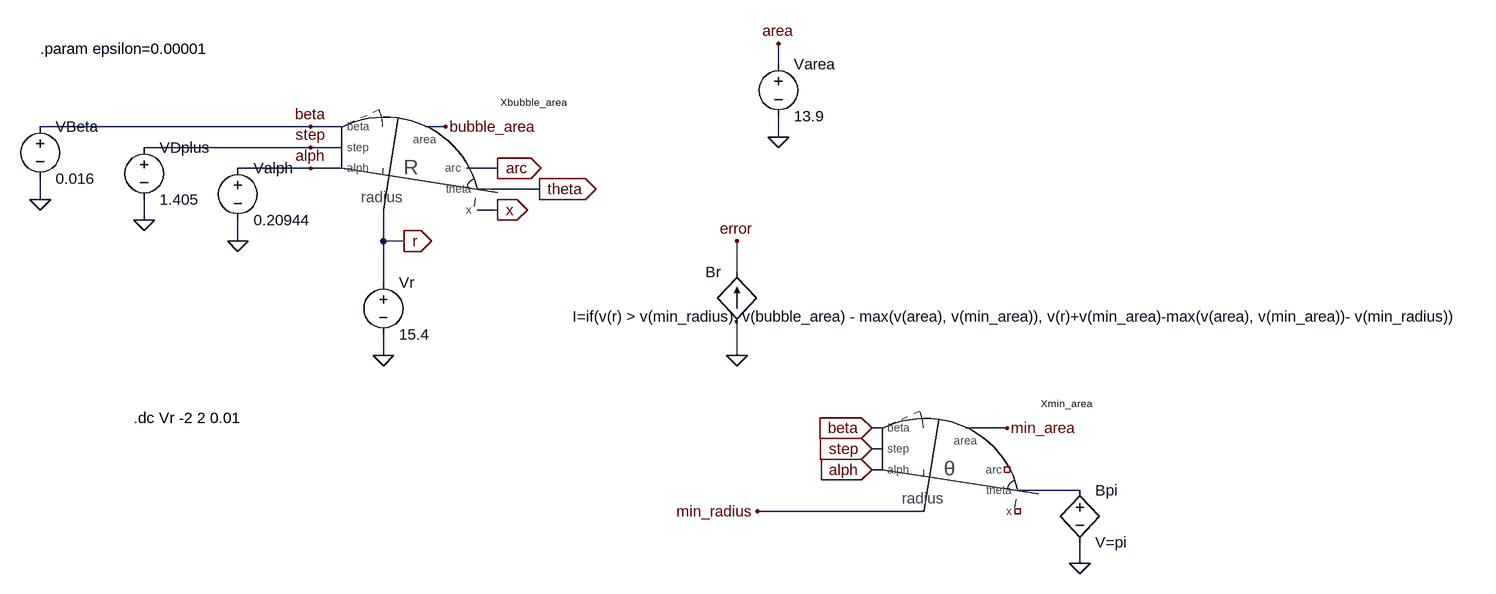
[diagram p0: schematic bubble_volume_min_test.asc]
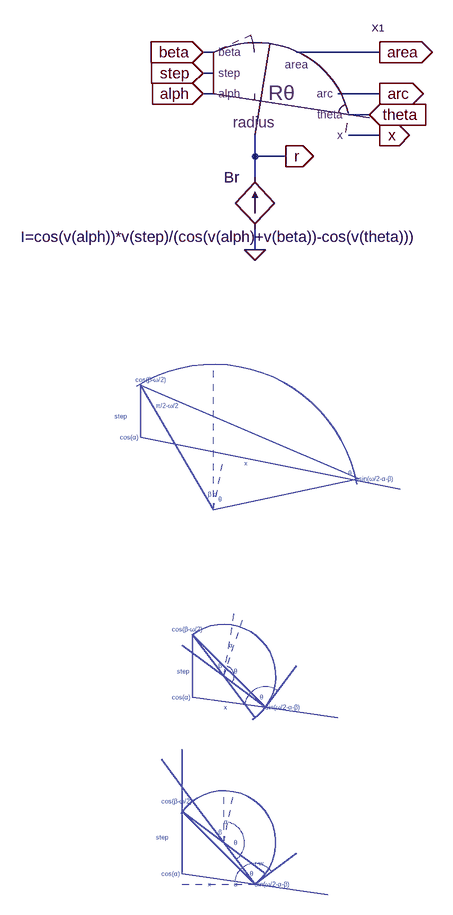
[diagram p1: sub-circuit bubble_volume_theta.asc]
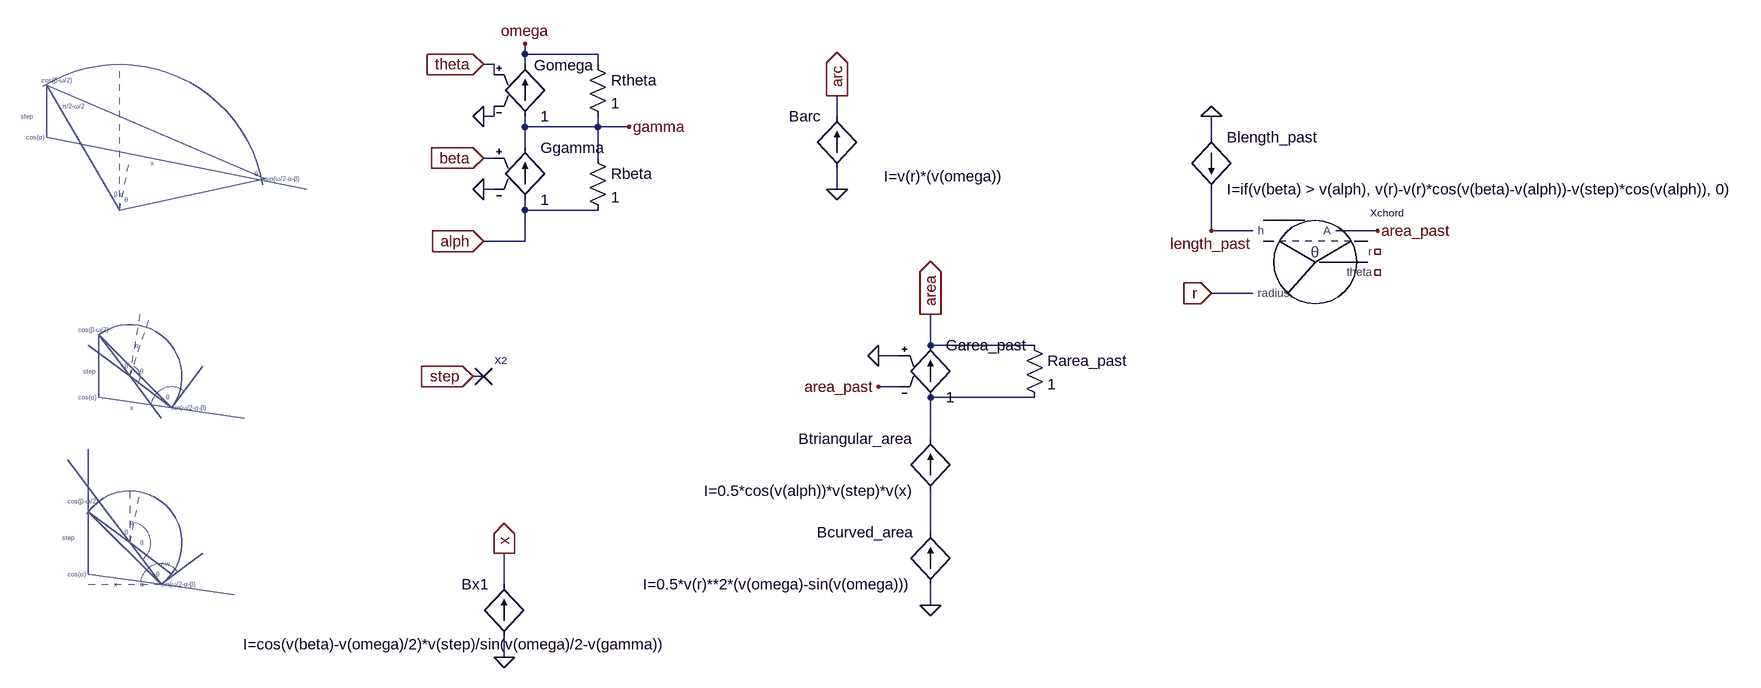
[diagram p2: sub-circuit bubble_volume_r-theta.asc]
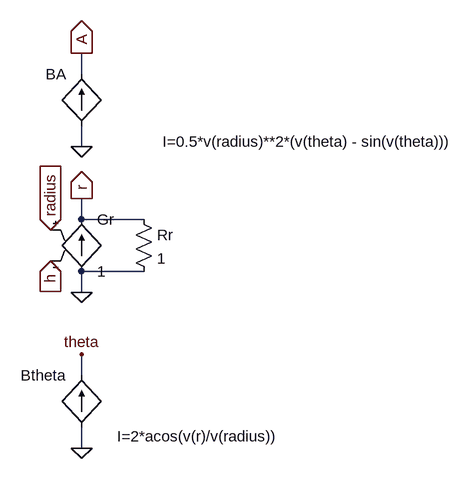
[diagram p3: sub-circuit chord.asc]
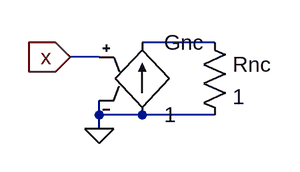
[diagram p4: sub-circuit nc.asc]
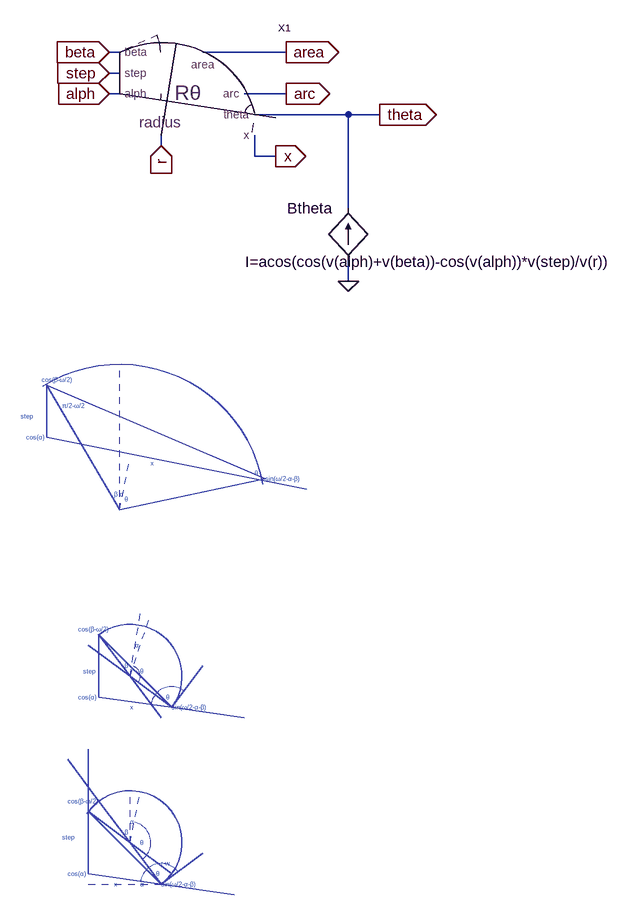
[diagram p5: sub-circuit bubble_volume_r.asc]
bubble_volume_min_test.asc, the LTspice schematic file:
Version 4
SHEET 1 2232 852
WIRE 864 -64 864 -96
WIRE 144 32 -272 32
WIRE 192 32 144 32
WIRE 352 32 320 32
WIRE 864 48 864 16
WIRE 144 64 -112 64
WIRE 192 64 144 64
WIRE 144 96 32 96
WIRE 192 96 144 96
WIRE 432 96 384 96
WIRE 496 128 400 128
WIRE -272 144 -272 112
WIRE 432 160 400 160
WIRE -112 176 -112 144
WIRE 32 208 32 176
WIRE 256 208 256 160
WIRE 288 208 256 208
WIRE 800 256 800 208
WIRE 256 272 256 208
WIRE 256 384 256 352
WIRE 800 384 800 336
WIRE 1024 496 1008 496
WIRE 1216 496 1152 496
WIRE 1024 528 1008 528
WIRE 1024 560 1008 560
WIRE 1328 592 1232 592
WIRE 1088 624 832 624
WIRE 1328 704 1328 672
FLAG 288 208 r
IOPIN 288 208 Out
FLAG 496 128 theta
IOPIN 496 128 Out
FLAG 432 96 arc
IOPIN 432 96 Out
FLAG 352 32 bubble_area
FLAG 432 160 x
IOPIN 432 160 Out
FLAG 1008 528 step
IOPIN 1008 528 In
FLAG 1008 560 alph
IOPIN 1008 560 In
FLAG 1008 496 beta
IOPIN 1008 496 In
FLAG 1328 704 0
FLAG 1216 496 min_area
FLAG 832 624 min_radius
FLAG 800 384 0
FLAG -272 144 0
FLAG -112 176 0
FLAG 32 208 0
FLAG 144 32 beta
FLAG 144 64 step
FLAG 144 96 alph
FLAG 800 208 error
FLAG 256 384 0
FLAG 864 -96 area
FLAG 864 48 0
SYMBOL bubble_volume_theta 1120 560 R0
SYMATTR InstName Xmin_area
SYMBOL bv 1328 576 R0
SYMATTR InstName Bpi
SYMATTR Value V=pi
SYMBOL bubble_volume_r 288 96 R0
SYMATTR InstName Xbubble_area
SYMBOL bi 800 336 R180
WINDOW 0 24 80 Left 2
WINDOW 3 -1137 12 Left 2
SYMATTR InstName Br
SYMATTR Value I=if(v(r) > v(min_radius), v(bubble_area) - max(v(area), v(min_area)), v(r)+v(min_area)-max(v(area), v(min_area))- v(min_radius))
SYMATTR SpiceLine rpar=1
SYMBOL voltage -112 48 R0
SYMATTR InstName VDplus
SYMATTR Value 1.405
SYMBOL voltage 32 80 R0
SYMATTR InstName Valph
SYMATTR Value 0.20944
SYMBOL voltage -272 16 R0
SYMATTR InstName VBeta
SYMATTR Value 0.016
SYMBOL voltage 256 256 R0
SYMATTR InstName Vr
SYMATTR Value 15.4
SYMBOL voltage 864 -80 R0
SYMATTR InstName Varea
SYMATTR Value 13.9
TEXT -272 -88 Left 2 !.param epsilon=0.00001
TEXT -128 480 Left 2 !.dc Vr -2 2 0.01

bubble_volume_theta.asc, the sub-circuit schematic file:
Version 4
SHEET 1 2232 852
WIRE -720 -464 -736 -464
WIRE -464 -464 -592 -464
WIRE -720 -432 -736 -432
WIRE -720 -400 -736 -400
WIRE -464 -400 -528 -400
WIRE -480 -368 -512 -368
WIRE -464 -336 -512 -336
WIRE -656 -304 -656 -336
WIRE -608 -304 -656 -304
WIRE -656 -272 -656 -304
WIRE -656 -160 -656 -192
FLAG -464 -464 area
IOPIN -464 -464 Out
FLAG -464 -400 arc
IOPIN -464 -400 Out
FLAG -464 -336 x
IOPIN -464 -336 Out
FLAG -736 -432 step
IOPIN -736 -432 In
FLAG -480 -368 theta
IOPIN -480 -368 In
FLAG -736 -464 beta
IOPIN -736 -464 In
FLAG -736 -400 alph
IOPIN -736 -400 In
FLAG -608 -304 r
IOPIN -608 -304 Out
FLAG -656 -160 0
SYMBOL bi -656 -192 R180
WINDOW 0 24 80 Left 2
WINDOW 3 -258 -12 Left 2
SYMATTR InstName Br
SYMATTR Value I=cos(v(alph))*v(step)/(cos(v(alph)+v(beta))-cos(v(theta)))
SYMATTR SpiceLine rpar=1
SYMBOL bubble_volume_r-theta -624 -400 R0
SYMATTR InstName X1
TEXT -872 96 Left 0 ;step
TEXT -840 40 Left 0 ;cos(β-ω/2)
TEXT -728 216 Left 0 ;β
TEXT -720 216 Left 0 ;α
TEXT -712 224 Left 0 ;θ
TEXT -512 184 Left 0 ;θ
TEXT -864 128 Left 0 ;cos(α)
TEXT -776 488 Left 0 ;step
TEXT -688 488 Left 0 ;θ
TEXT -648 528 Left 0 ;θ
TEXT -784 528 Left 0 ;cos(α)
TEXT -712 480 Left 0 ;β
TEXT -696 448 Left 0 ;α
TEXT -808 744 Left 0 ;step
TEXT -688 816 Left 0 ;α
TEXT -688 752 Left 0 ;θ
TEXT -664 800 Left 0 ;θ
TEXT -800 800 Left 0 ;cos(α)
TEXT -712 736 Left 0 ;β
TEXT -704 720 Left 0 ;α
TEXT -656 784 Left 0 ;r-w
TEXT -672 168 Left 0 ;x
TEXT -704 544 Left 0 ;x
TEXT -784 424 Left 0 ;cos(β-ω/2)
TEXT -728 816 Left 0 ;x
TEXT -800 688 Left 0 ;cos(β-ω/2)
TEXT -808 80 Left 0 ;π/2-ω/2
TEXT -496 192 Left 0 ;sin(ω/2-α-β)
TEXT -640 544 Left 0 ;sin(ω/2-α-β)
TEXT -656 816 Left 0 ;sin(ω/2-α-β)
LINE Normal -832 128 -832 48
LINE Normal -832 128 -432 208
LINE Normal -720 240 -832 48
LINE Normal -720 240 -720 16 2
LINE Normal -720 240 -704 160 2
LINE Normal -496 192 -720 240
LINE Normal -752 528 -752 432
LINE Normal -752 528 -640 544
LINE Normal -704 496 -752 432
LINE Normal -704 496 -688 400 2
LINE Normal -704 496 -672 400 2
LINE Normal -640 544 -592 480
LINE Normal -640 544 -704 496
LINE Normal -640 544 -528 560
LINE Normal -640 544 -752 432
LINE Normal -768 800 -768 704
LINE Normal -768 800 -656 816
LINE Normal -704 752 -768 704
LINE Normal -704 752 -704 672 2
LINE Normal -704 752 -688 672 2
LINE Normal -656 816 -592 768
LINE Normal -768 816 -656 816 2
LINE Normal -656 816 -704 752
LINE Normal -640 800 -704 752
LINE Normal -656 816 -544 832
LINE Normal -656 816 -768 704
LINE Normal -656 560 -704 496
LINE Normal -704 496 -768 448
LINE Normal -704 752 -752 688
LINE Normal -752 688 -800 624
LINE Normal -768 704 -768 608
LINE Normal -496 192 -832 48
ARC Normal -944 16 -496 464 -506 202 -839 48
ARC Normal -784 416 -624 576 -602 650 -791 384
ARC Normal -672 512 -608 576 -560 442 -747 530 2
ARC Normal -720 480 -688 512 -672 522 -683 434 2
ARC Normal -784 672 -624 832 -650 826 -775 704
ARC Normal -688 784 -624 848 -608 778 -763 802 2
ARC Normal -736 720 -672 784 -672 794 -683 658 2

bubble_volume_r-theta.asc, the sub-circuit schematic file:
Version 4
SHEET 1 2232 852
WIRE -144 -720 -144 -736
WIRE -32 -720 -144 -720
WIRE -192 -704 -208 -704
WIRE -144 -704 -144 -720
WIRE -32 -704 -32 -720
WIRE -192 -688 -192 -704
WIRE -192 -624 -192 -640
WIRE -192 -624 -208 -624
WIRE 336 -624 336 -656
WIRE -144 -608 -144 -624
WIRE -32 -608 -32 -624
WIRE -32 -608 -144 -608
WIRE 16 -608 -32 -608
WIRE 912 -592 912 -624
WIRE -144 -576 -144 -608
WIRE -192 -560 -208 -560
WIRE -32 -560 -32 -608
WIRE -192 -512 -208 -512
WIRE 336 -512 336 -544
WIRE -144 -480 -144 -496
WIRE -32 -480 -144 -480
WIRE 912 -448 912 -512
WIRE 976 -448 912 -448
WIRE 1168 -448 1104 -448
WIRE -144 -432 -144 -480
WIRE -144 -432 -208 -432
WIRE 976 -352 912 -352
WIRE 480 -272 480 -320
WIRE 640 -272 480 -272
WIRE 432 -256 400 -256
WIRE -208 -224 -224 -224
WIRE 432 -208 400 -208
WIRE 640 -192 480 -192
WIRE 480 -128 480 -192
WIRE 480 16 480 -48
WIRE -176 96 -176 48
WIRE 480 128 480 96
WIRE -176 208 -176 176
FLAG 912 -352 r
IOPIN 912 -352 In
FLAG 912 -448 length_past
FLAG -208 -704 theta
IOPIN -208 -704 In
FLAG 912 -624 0
FLAG 480 128 0
FLAG -208 -560 beta
IOPIN -208 -560 In
FLAG -224 -224 step
IOPIN -224 -224 In
FLAG -208 -432 alph
IOPIN -208 -432 In
FLAG 480 -320 area
IOPIN 480 -320 Out
FLAG 336 -656 arc
IOPIN 336 -656 Out
FLAG 1168 -448 area_past
FLAG 336 -512 0
FLAG -208 -624 0
FLAG -144 -736 omega
FLAG 16 -608 gamma
FLAG -208 -512 0
FLAG 400 -208 area_past
FLAG 400 -256 0
FLAG -176 48 x
IOPIN -176 48 Out
FLAG -176 208 0
SYMBOL chord 1072 -400 R0
SYMATTR InstName Xchord
SYMBOL bi 336 -544 R180
WINDOW 0 24 80 Left 2
WINDOW 3 -258 -12 Left 2
SYMATTR InstName Barc
SYMATTR Value I=v(r)*(v(omega))
SYMATTR SpiceLine rpar=1
SYMBOL nc -208 -224 R0
SYMATTR InstName X2
SYMBOL bi -176 176 R180
WINDOW 0 24 80 Left 2
WINDOW 3 -258 -12 Left 2
SYMATTR InstName Bx1
SYMATTR Value I=cos(v(beta)-v(omega)/2)*v(step)/sin(v(omega)/2-v(gamma))
SYMATTR SpiceLine rpar=1
SYMBOL g -144 -720 R0
WINDOW 0 14 17 Left 2
SYMATTR InstName Gomega
SYMATTR Value 1
SYMBOL g -144 -592 R0
SYMATTR InstName Ggamma
SYMATTR Value 1
SYMBOL g 480 -288 R0
SYMATTR InstName Garea_past
SYMATTR Value 1
SYMBOL bi 912 -592 R0
SYMATTR InstName Blength_past
SYMATTR Value I=if(v(beta) > v(alph), v(r)-v(r)*cos(v(beta)-v(alph))-v(step)*cos(v(alph)), 0)
SYMATTR SpiceLine rpar=1
SYMBOL res -48 -576 R0
SYMATTR InstName Rbeta
SYMATTR Value 1
SYMBOL res -48 -720 R0
SYMATTR InstName Rtheta
SYMATTR Value 1
SYMBOL bi 480 -48 R180
WINDOW 0 24 80 Left 2
WINDOW 3 24 0 Left 2
SYMATTR InstName Btriangular_area
SYMATTR Value I=0.5*cos(v(alph))*v(step)*v(x)
SYMATTR SpiceLine rpar=1
SYMBOL bi 480 96 R180
WINDOW 0 24 80 Left 2
WINDOW 3 24 0 Left 2
SYMATTR InstName Bcurved_area
SYMATTR Value I=0.5*v(r)**2*(v(omega)-sin(v(omega)))
SYMATTR SpiceLine rpar=1
SYMBOL res 624 -288 R0
SYMATTR InstName Rarea_past
SYMATTR Value 1
TEXT -920 -624 Left 0 ;step
TEXT -888 -680 Left 0 ;cos(β-ω/2)
TEXT -776 -504 Left 0 ;β
TEXT -768 -504 Left 0 ;α
TEXT -760 -496 Left 0 ;θ
TEXT -560 -536 Left 0 ;θ
TEXT -912 -592 Left 0 ;cos(α)
TEXT -824 -232 Left 0 ;step
TEXT -736 -232 Left 0 ;θ
TEXT -696 -192 Left 0 ;θ
TEXT -832 -192 Left 0 ;cos(α)
TEXT -760 -240 Left 0 ;β
TEXT -744 -272 Left 0 ;α
TEXT -856 24 Left 0 ;step
TEXT -736 96 Left 0 ;α
TEXT -736 32 Left 0 ;θ
TEXT -712 80 Left 0 ;θ
TEXT -848 80 Left 0 ;cos(α)
TEXT -760 16 Left 0 ;β
TEXT -752 0 Left 0 ;α
TEXT -704 64 Left 0 ;r-w
TEXT -720 -552 Left 0 ;x
TEXT -752 -176 Left 0 ;x
TEXT -544 -528 Left 0 ;sin(ω/2-α-β)
TEXT -832 -296 Left 0 ;cos(β-ω/2)
TEXT -776 96 Left 0 ;x
TEXT -848 -32 Left 0 ;cos(β-ω/2)
TEXT -856 -640 Left 0 ;π/2-ω/2
TEXT -688 -176 Left 0 ;sin(ω/2-α-β)
TEXT -704 96 Left 0 ;sin(ω/2-α-β)
LINE Normal -880 -592 -880 -672
LINE Normal -880 -592 -480 -512
LINE Normal -768 -480 -880 -672
LINE Normal -768 -480 -768 -704 2
LINE Normal -768 -480 -752 -560 2
LINE Normal -544 -528 -768 -480
LINE Normal -800 -192 -800 -288
LINE Normal -800 -192 -688 -176
LINE Normal -752 -224 -800 -288
LINE Normal -752 -224 -736 -320 2
LINE Normal -752 -224 -720 -320 2
LINE Normal -688 -176 -640 -240
LINE Normal -688 -176 -752 -224
LINE Normal -688 -176 -576 -160
LINE Normal -688 -176 -800 -288
LINE Normal -816 80 -816 -16
LINE Normal -816 80 -704 96
LINE Normal -752 32 -816 -16
LINE Normal -752 32 -752 -48 2
LINE Normal -752 32 -736 -48 2
LINE Normal -704 96 -640 48
LINE Normal -816 96 -704 96 2
LINE Normal -704 96 -752 32
LINE Normal -688 80 -752 32
LINE Normal -704 96 -592 112
LINE Normal -704 96 -816 -16
LINE Normal -704 -160 -752 -224
LINE Normal -752 -224 -816 -272
LINE Normal -752 32 -800 -32
LINE Normal -800 -32 -848 -96
LINE Normal -816 -16 -816 -112
LINE Normal -544 -528 -880 -672
ARC Normal -992 -704 -544 -256 -554 -518 -887 -672
ARC Normal -832 -304 -672 -144 -650 -150 -839 -336
ARC Normal -720 -208 -656 -144 -608 -278 -795 -190 2
ARC Normal -768 -240 -736 -208 -720 -198 -731 -286 2
ARC Normal -832 -48 -672 112 -698 106 -823 -16
ARC Normal -736 64 -672 128 -656 58 -811 82 2
ARC Normal -784 0 -720 64 -720 74 -731 -62 2

chord.asc, the sub-circuit schematic file:
Version 4
SHEET 1 1588 680
WIRE 320 -96 320 -128
WIRE 320 16 320 -16
WIRE 320 128 320 96
WIRE 416 128 320 128
WIRE 416 208 320 208
WIRE 320 240 320 208
WIRE 320 368 320 336
WIRE 320 480 320 448
FLAG 272 192 h
IOPIN 272 192 In
FLAG 272 144 radius
IOPIN 272 144 In
FLAG 320 -128 A
IOPIN 320 -128 Out
FLAG 320 96 r
IOPIN 320 96 Out
FLAG 320 480 0
FLAG 320 336 theta
FLAG 320 16 0
FLAG 320 240 0
SYMBOL bi 320 448 R180
WINDOW 0 24 80 Left 2
WINDOW 3 -304 -14 Left 2
SYMATTR InstName Btheta
SYMATTR Value I=2*acos(v(r)/v(radius))
SYMATTR SpiceLine rpar=1
SYMBOL bi 320 -16 R180
WINDOW 0 24 80 Left 2
WINDOW 3 -574 -24 Left 2
SYMATTR InstName BA
SYMATTR Value I=0.5*v(radius)**2*(v(theta) - sin(v(theta)))
SYMATTR SpiceLine rpar=1
SYMBOL g 320 112 R0
SYMATTR InstName Gr
SYMATTR Value 1
SYMBOL res 400 112 R0
SYMATTR InstName Rr
SYMATTR Value 1

nc.asc, the sub-circuit schematic file:
Version 4
SHEET 1 880 680
WIRE 288 160 208 160
WIRE 160 176 128 176
WIRE 160 240 160 224
WIRE 208 240 160 240
WIRE 288 240 208 240
WIRE 160 256 160 240
FLAG 128 176 x
IOPIN 128 176 In
FLAG 160 256 0
SYMBOL res 272 144 R0
SYMATTR InstName Rnc
SYMATTR Value 1
SYMBOL g 208 144 R0
SYMATTR InstName Gnc
SYMATTR Value 1

bubble_volume_r.asc, the sub-circuit schematic file:
Version 4
SHEET 1 2232 852
WIRE -720 -464 -736 -464
WIRE -464 -464 -592 -464
WIRE -720 -432 -736 -432
WIRE -720 -400 -736 -400
WIRE -464 -400 -528 -400
WIRE -368 -368 -512 -368
WIRE -320 -368 -368 -368
WIRE -656 -320 -656 -336
WIRE -512 -304 -512 -336
WIRE -480 -304 -512 -304
WIRE -368 -224 -368 -368
WIRE -368 -112 -368 -144
FLAG -464 -464 area
IOPIN -464 -464 Out
FLAG -464 -400 arc
IOPIN -464 -400 Out
FLAG -480 -304 x
IOPIN -480 -304 Out
FLAG -368 -112 0
FLAG -736 -432 step
IOPIN -736 -432 In
FLAG -320 -368 theta
IOPIN -320 -368 Out
FLAG -736 -464 beta
IOPIN -736 -464 In
FLAG -736 -400 alph
IOPIN -736 -400 In
FLAG -656 -320 r
IOPIN -656 -320 In
SYMBOL bi -368 -144 R180
WINDOW 0 24 80 Left 2
WINDOW 3 -411 -2 Left 2
SYMATTR InstName Btheta
SYMATTR Value I=acos(cos(v(alph)+v(beta))-cos(v(alph))*v(step)/v(r))
SYMATTR SpiceLine rpar=1
SYMBOL bubble_volume_r-theta -624 -400 R0
SYMATTR InstName X1
TEXT -872 96 Left 0 ;step
TEXT -840 40 Left 0 ;cos(β-ω/2)
TEXT -728 216 Left 0 ;β
TEXT -720 216 Left 0 ;α
TEXT -712 224 Left 0 ;θ
TEXT -512 184 Left 0 ;θ
TEXT -864 128 Left 0 ;cos(α)
TEXT -776 488 Left 0 ;step
TEXT -688 488 Left 0 ;θ
TEXT -648 528 Left 0 ;θ
TEXT -784 528 Left 0 ;cos(α)
TEXT -712 480 Left 0 ;β
TEXT -696 448 Left 0 ;α
TEXT -808 744 Left 0 ;step
TEXT -688 816 Left 0 ;α
TEXT -688 752 Left 0 ;θ
TEXT -664 800 Left 0 ;θ
TEXT -800 800 Left 0 ;cos(α)
TEXT -712 736 Left 0 ;β
TEXT -704 720 Left 0 ;α
TEXT -656 784 Left 0 ;r-w
TEXT -672 168 Left 0 ;x
TEXT -704 544 Left 0 ;x
TEXT -784 424 Left 0 ;cos(β-ω/2)
TEXT -728 816 Left 0 ;x
TEXT -800 688 Left 0 ;cos(β-ω/2)
TEXT -808 80 Left 0 ;π/2-ω/2
TEXT -496 192 Left 0 ;sin(ω/2-α-β)
TEXT -640 544 Left 0 ;sin(ω/2-α-β)
TEXT -656 816 Left 0 ;sin(ω/2-α-β)
LINE Normal -832 128 -832 48
LINE Normal -832 128 -432 208
LINE Normal -720 240 -832 48
LINE Normal -720 240 -720 16 2
LINE Normal -720 240 -704 160 2
LINE Normal -496 192 -720 240
LINE Normal -752 528 -752 432
LINE Normal -752 528 -640 544
LINE Normal -704 496 -752 432
LINE Normal -704 496 -688 400 2
LINE Normal -704 496 -672 400 2
LINE Normal -640 544 -592 480
LINE Normal -640 544 -704 496
LINE Normal -640 544 -528 560
LINE Normal -640 544 -752 432
LINE Normal -768 800 -768 704
LINE Normal -768 800 -656 816
LINE Normal -704 752 -768 704
LINE Normal -704 752 -704 672 2
LINE Normal -704 752 -688 672 2
LINE Normal -656 816 -592 768
LINE Normal -768 816 -656 816 2
LINE Normal -656 816 -704 752
LINE Normal -640 800 -704 752
LINE Normal -656 816 -544 832
LINE Normal -656 816 -768 704
LINE Normal -656 560 -704 496
LINE Normal -704 496 -768 448
LINE Normal -704 752 -752 688
LINE Normal -752 688 -800 624
LINE Normal -768 704 -768 608
LINE Normal -496 192 -832 48
ARC Normal -944 16 -496 464 -506 202 -839 48
ARC Normal -784 416 -624 576 -602 570 -791 384
ARC Normal -672 512 -608 576 -560 442 -747 530 2
ARC Normal -720 480 -688 512 -672 522 -683 434 2
ARC Normal -784 672 -624 832 -650 826 -775 704
ARC Normal -688 784 -624 848 -608 778 -763 802 2
ARC Normal -736 720 -672 784 -672 794 -683 658 2

The netlist it stands for:
* bubble_volume_min_test.asc
XXmin_area alph beta step min_area min_radius N001 NC_01 NC_02 bubble_volume_theta
Bpi N001 0 V=pi
XXbubble_area alph beta step bubble_area r theta arc x bubble_volume_r
Br 0 error I=if(v(r) > v(min_radius), v(bubble_area) - max(v(area), v(min_area)), v(r)+v(min_area)-max(v(area), v(min_area))- v(min_radius)) rpar=1
VDplus step 0 1.405
Valph alph 0 0.20944
VBeta beta 0 0.016
Vr r 0 15.4
Varea area 0 13.9

* block symbol definitions
.subckt bubble_volume_theta alph beta step area r theta arc x
Br 0 r I=cos(v(alph))*v(step)/(cos(v(alph)+v(beta))-cos(v(theta))) rpar=1
XX1 alph beta step area r theta arc x bubble_volume_r-theta
* step
* cos(β-ω/2)
* β
* α
* θ
* θ
* cos(α)
* step
* θ
* θ
* cos(α)
* β
* α
* step
* α
* θ
* θ
* cos(α)
* β
* α
* r-w
* x
* x
* cos(β-ω/2)
* x
* cos(β-ω/2)
* π/2-ω/2
* sin(ω/2-α-β)
* sin(ω/2-α-β)
* sin(ω/2-α-β)
.ends bubble_volume_theta

.subckt bubble_volume_r-theta alph beta step area r theta arc x
XXchord length_past r area_past NC_01 NC_02 chord
Barc 0 arc I=v(r)*(v(omega)) rpar=1
XX2 step nc
Bx1 0 x I=cos(v(beta)-v(omega)/2)*v(step)/sin(v(omega)/2-v(gamma)) rpar=1
Gomega gamma omega theta 0 1
Ggamma alph gamma beta 0 1
Garea_past N001 area 0 area_past 1
Blength_past 0 length_past I=if(v(beta) > v(alph), v(r)-v(r)*cos(v(beta)-v(alph))-v(step)*cos(v(alph)), 0) rpar=1
Rbeta gamma alph 1
Rtheta omega gamma 1
Btriangular_area N002 N001 I=0.5*cos(v(alph))*v(step)*v(x) rpar=1
Bcurved_area 0 N002 I=0.5*v(r)**2*(v(omega)-sin(v(omega))) rpar=1
Rarea_past area N001 1
* step
* cos(β-ω/2)
* β
* α
* θ
* θ
* cos(α)
* step
* θ
* θ
* cos(α)
* β
* α
* step
* α
* θ
* θ
* cos(α)
* β
* α
* r-w
* x
* x
* sin(ω/2-α-β)
* cos(β-ω/2)
* x
* cos(β-ω/2)
* π/2-ω/2
* sin(ω/2-α-β)
* sin(ω/2-α-β)
.ends bubble_volume_r-theta

.subckt chord h radius A r theta
Btheta 0 theta I=2*acos(v(r)/v(radius)) rpar=1
BA 0 A I=0.5*v(radius)**2*(v(theta) - sin(v(theta))) rpar=1
Gr 0 r radius h 1
Rr r 0 1
.ends chord

.subckt nc x
Rnc N001 0 1
Gnc 0 N001 x 0 1
.ends nc

.subckt bubble_volume_r alph beta step area r theta arc x
Btheta 0 theta I=acos(cos(v(alph)+v(beta))-cos(v(alph))*v(step)/v(r)) rpar=1
XX1 alph beta step area r theta arc x bubble_volume_r-theta
* step
* cos(β-ω/2)
* β
* α
* θ
* θ
* cos(α)
* step
* θ
* θ
* cos(α)
* β
* α
* step
* α
* θ
* θ
* cos(α)
* β
* α
* r-w
* x
* x
* cos(β-ω/2)
* x
* cos(β-ω/2)
* π/2-ω/2
* sin(ω/2-α-β)
* sin(ω/2-α-β)
* sin(ω/2-α-β)
.ends bubble_volume_r

.param epsilon=0.00001
.dc Vr -2 2 0.01
.backanno
.end

* Results of the author's LTspice run, read from the files saved beside the schematic
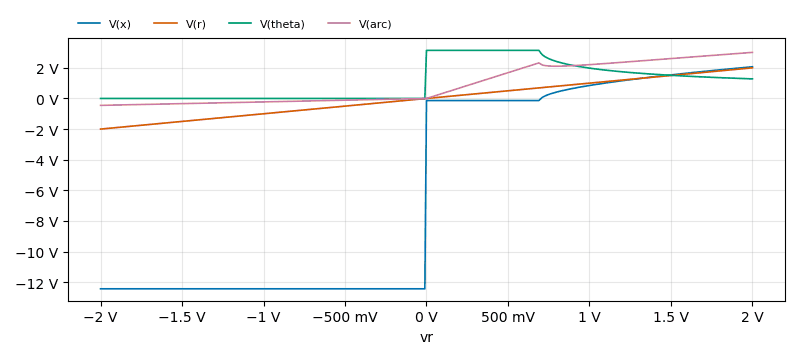
[diagram p6: DC transfer characteristic of bubble_volume_min_test.asc, plotted from the saved traces]
* DC transfer characteristic, 1 run:
*   V(x): -12.43 V at vr=-2 V, 2.071 V at vr=2 V, min -12.43 V, max 2.071 V
*   V(r): -2 V at vr=-2 V, 2 V at vr=2 V, min -2 V, max 2 V
*   V(theta): 0 V at vr=-2 V, 1.279 V at vr=2 V, min 0 V, max 3.142 V
*   V(arc): -450.9 mV at vr=-2 V, 3.009 V at vr=2 V, min -450.9 mV, max 3.009 V